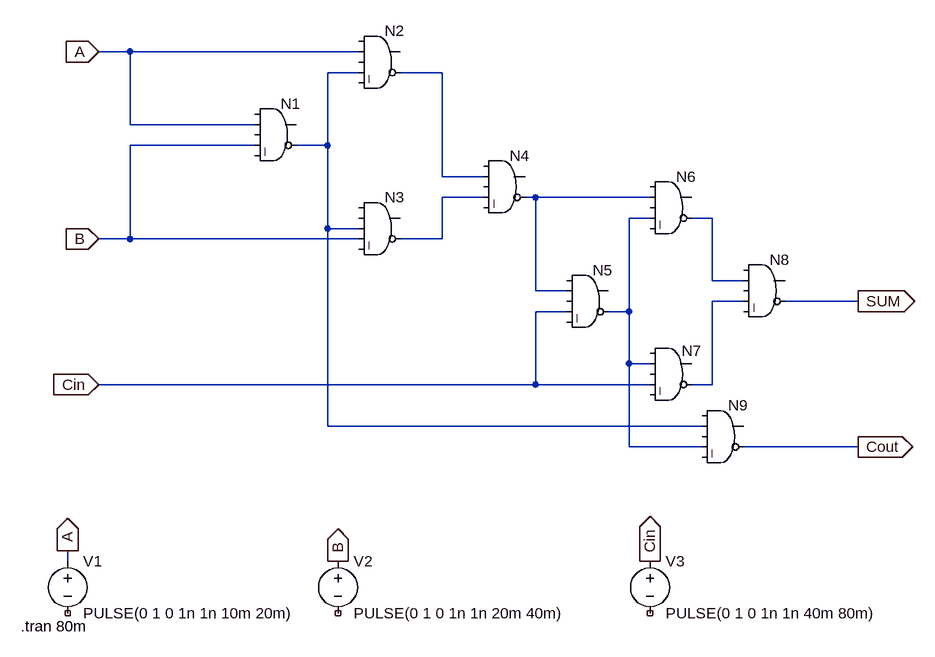
[diagram p0: schematic P1.asc]
P1.asc, the LTspice schematic file:
Version 4
SHEET 1 880 680
WIRE -1504 -1552 -1552 -1552
WIRE -1152 -1552 -1504 -1552
WIRE -1152 -1520 -1200 -1520
WIRE -1024 -1520 -1088 -1520
WIRE -1504 -1440 -1504 -1552
WIRE -1312 -1440 -1504 -1440
WIRE -1312 -1408 -1504 -1408
WIRE -1200 -1408 -1200 -1520
WIRE -1200 -1408 -1248 -1408
WIRE -1024 -1360 -1024 -1520
WIRE -960 -1360 -1024 -1360
WIRE -960 -1328 -1024 -1328
WIRE -880 -1328 -896 -1328
WIRE -704 -1328 -880 -1328
WIRE -704 -1296 -736 -1296
WIRE -608 -1296 -640 -1296
WIRE -1200 -1280 -1200 -1408
WIRE -1152 -1280 -1200 -1280
WIRE -1504 -1264 -1504 -1408
WIRE -1504 -1264 -1552 -1264
WIRE -1152 -1264 -1504 -1264
WIRE -1024 -1264 -1024 -1328
WIRE -1024 -1264 -1088 -1264
WIRE -608 -1200 -608 -1296
WIRE -560 -1200 -608 -1200
WIRE -880 -1184 -880 -1328
WIRE -832 -1184 -880 -1184
WIRE -560 -1168 -608 -1168
WIRE -384 -1168 -496 -1168
WIRE -832 -1152 -880 -1152
WIRE -736 -1152 -736 -1296
WIRE -736 -1152 -768 -1152
WIRE -736 -1072 -736 -1152
WIRE -704 -1072 -736 -1072
WIRE -880 -1040 -880 -1152
WIRE -880 -1040 -1552 -1040
WIRE -704 -1040 -880 -1040
WIRE -608 -1040 -608 -1168
WIRE -608 -1040 -640 -1040
WIRE -1200 -976 -1200 -1280
WIRE -624 -976 -1200 -976
WIRE -736 -944 -736 -1072
WIRE -624 -944 -736 -944
WIRE -384 -944 -560 -944
WIRE -1600 -768 -1600 -784
FLAG -1552 -1552 A
IOPIN -1552 -1552 In
FLAG -1552 -1264 B
IOPIN -1552 -1264 In
FLAG -1552 -1040 Cin
IOPIN -1552 -1040 In
FLAG -384 -1168 SUM
IOPIN -384 -1168 Out
FLAG -384 -944 Cout
IOPIN -384 -944 Out
FLAG -1184 -768 B
IOPIN -1184 -768 Out
FLAG -704 -768 Cin
IOPIN -704 -768 Out
FLAG -1600 -784 A
IOPIN -1600 -784 Out
SYMBOL Digital\\and -1120 -1600 R0
SYMATTR InstName N2
SYMBOL Digital\\and -1280 -1488 R0
SYMATTR InstName N1
SYMBOL Digital\\and -1120 -1344 R0
SYMATTR InstName N3
SYMBOL Digital\\and -928 -1408 R0
SYMATTR InstName N4
SYMBOL Digital\\and -672 -1376 R0
SYMATTR InstName N6
SYMBOL Digital\\and -800 -1232 R0
SYMATTR InstName N5
SYMBOL Digital\\and -672 -1120 R0
WINDOW 0 17 28 Left 2
SYMATTR InstName N7
SYMBOL Digital\\and -528 -1248 R0
SYMATTR InstName N8
SYMBOL Digital\\and -592 -1024 R0
SYMATTR InstName N9
SYMBOL voltage -1600 -784 R0
WINDOW 123 0 0 Left 0
WINDOW 39 0 0 Left 0
SYMATTR InstName V1
SYMATTR Value PULSE(0 1 0 1n 1n 10m 20m)
SYMBOL voltage -704 -784 R0
WINDOW 123 0 0 Left 0
WINDOW 39 0 0 Left 0
SYMATTR InstName V3
SYMATTR Value PULSE(0 1 0 1n 1n 40m 80m)
SYMBOL voltage -1184 -784 R0
WINDOW 123 0 0 Left 0
WINDOW 39 0 0 Left 0
SYMATTR InstName V2
SYMATTR Value PULSE(0 1 0 1n 1n 20m 40m)
TEXT -1672 -668 Left 2 !.tran 80m

The netlist it stands for:
* P1.asc
A§N2 0 A 0 N001 0 N002 0 0 AND
A§N1 0 A 0 B 0 N001 0 0 AND
A§N3 0 0 N001 B 0 N003 0 0 AND
A§N4 0 N002 0 N003 0 N004 0 0 AND
A§N6 0 N004 0 N005 0 N006 0 0 AND
A§N5 0 N004 0 Cin 0 N005 0 0 AND
A§N7 0 N005 0 Cin 0 N007 0 0 AND
A§N8 0 N006 0 N007 0 SUM 0 0 AND
A§N9 0 N001 0 N005 0 Cout 0 0 AND
V1 A NC_01 PULSE(0 1 0 1n 1n 10m 20m)
V3 Cin NC_02 PULSE(0 1 0 1n 1n 40m 80m)
V2 B NC_03 PULSE(0 1 0 1n 1n 20m 40m)
.tran 80m
.backanno
.end